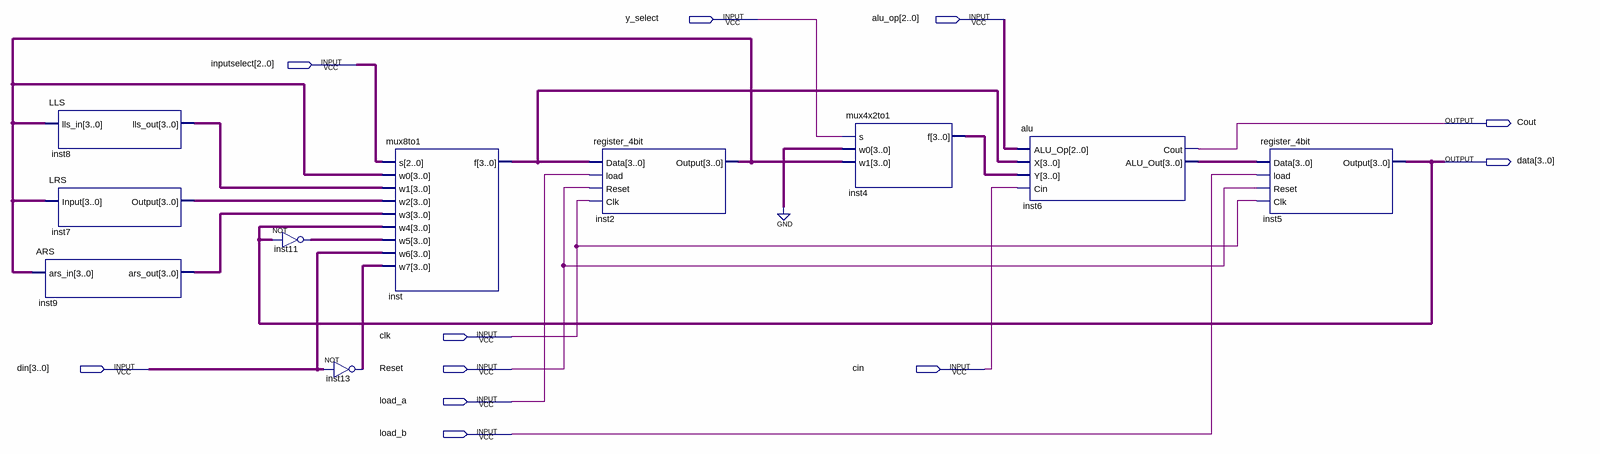
[diagram p0: schematic sheet]
// Quartus schematic Datapath.bdf as structural Verilog: 10 symbols, 11 pins
module Datapath (
  input  y_select,
  input  [2:0] alu_op,
  input  [2:0] inputselect,
  input  clk,
  input  [3:0] din,
  input  Reset,
  input  cin,
  input  load_a,
  input  load_b,
  output Cout,
  output [3:0] data
);

  wire [3:0] inst2_output, inst4_f, inst6_alu_out, inst7_output, inst8_lls_out, inst9_ars_out, inst11_out,
       inst13_out, inst_f;

  LLS inst8 (.lls_in(inst2_output), .lls_out(inst8_lls_out));
  LRS inst7 (.Input(inst2_output), .Output(inst7_output));
  ARS inst9 (.ars_in(inst2_output), .ars_out(inst9_ars_out));
  assign inst11_out = ~data;  // NOT inst11, 4 bits wide
  assign inst13_out = ~din;  // NOT inst13, 4 bits wide
  mux8to1 inst (
    .s(inputselect), .w0(inst2_output), .w1(inst8_lls_out), .w2(inst7_output), .w3(inst9_ars_out), .w4(data),
    .w5(inst11_out), .w6(din), .w7(inst13_out), .f(inst_f));
  register_4bit inst2 (.Data(inst_f), .load(load_a), .Reset(Reset), .Clk(clk), .Output(inst2_output));
  mux4x2to1 inst4 (.s(y_select), .w0(4'b0000), .w1(inst2_output), .f(inst4_f));
  alu inst6 (.ALU_Op(alu_op), .X(inst_f), .Y(inst4_f), .Cin(cin), .Cout(Cout), .ALU_Out(inst6_alu_out));
  register_4bit inst5 (.Data(inst6_alu_out), .load(load_b), .Reset(Reset), .Clk(clk), .Output(data));
endmodule
